# EAGLE design BLE v0.1a prater mod (EAGLE 6.4)
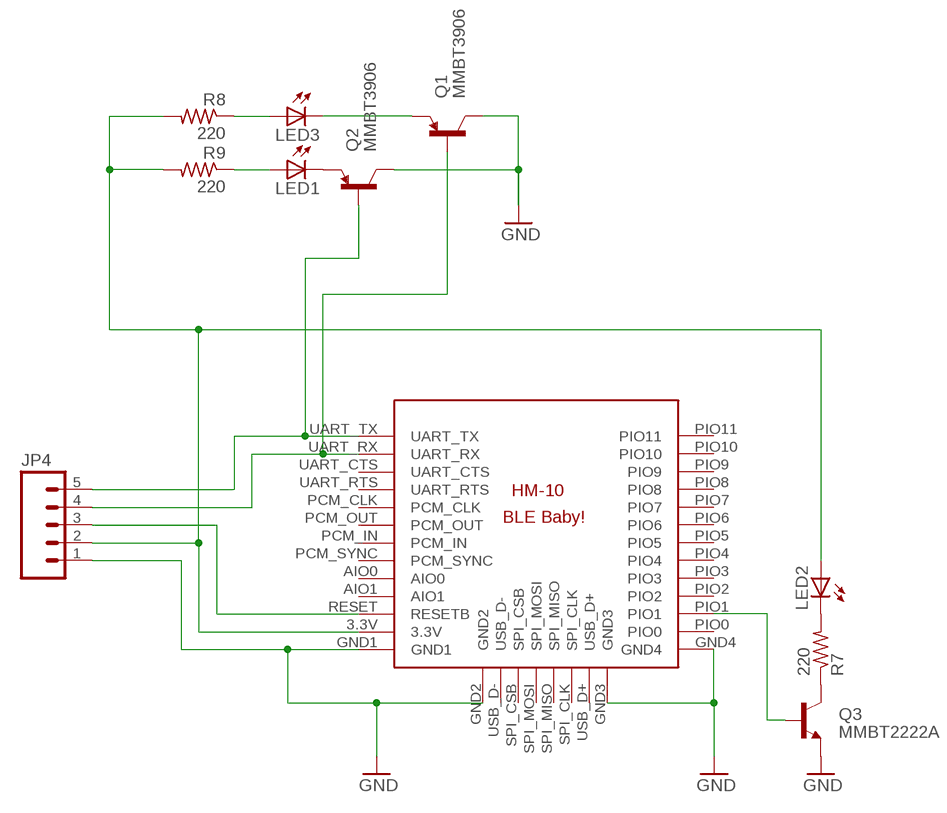
[diagram p0: schematic, sheet 1]

## Parts
JP4  M05PTH  [1X05]
LED1  LED0603  [LED-0603]
LED2  LED0603  [LED-0603]
LED3  LED0603  [LED-0603]
Q1  MMBT3906  TRANSISTOR_PNPMMBT3906  [SOT23]
Q2  MMBT3906  TRANSISTOR_PNPMMBT3906  [SOT23]
Q3  MMBT2222A  TRANSISTOR_NPNMMBT2222A  [SOT23]
R7  220  R-US_M0805  [M0805]
R8  220  R-US_M0805  [M0805]
R9  220  R-US_M0805  [M0805]
U$1  BLE-HM-10  [BLE-HM-10]

## Nets
GND: JP4.1 Q1.3(C) Q2.3(C) Q3.2(E) U$1.GND1 U$1.GND2 U$1.GND3 U$1.GND4
HVTX->LVRX: JP4.4 Q1.1(B) U$1.UART_RX
LVRX->HVTX: JP4.5 Q2.1(B) U$1.UART_TX
N$2: Q3.3(C) R7.1
N$4: JP4.2 LED2.A R8.2 R9.2 U$1.3.3V
N$5: JP4.3 U$1.RESET(RESETB)
N$25: Q3.1(B) U$1.PIO1
N$26: LED2.C R7.2
N$34: LED3.C Q1.2(E)
N$35: LED1.A R9.1
N$39: LED3.A R8.1
N$40: LED1.C Q2.2(E)
Unconnected: U$1.AIO0 U$1.AIO1 U$1.PCM_CLK U$1.PCM_IN U$1.PCM_OUT U$1.PCM_SYNC U$1.PIO0 U$1.PIO2 U$1.PIO3 U$1.PIO4 U$1.PIO5 U$1.PIO6 U$1.PIO7 U$1.PIO8 U$1.PIO9 U$1.PIO10 U$1.PIO11 U$1.SPI_CLK U$1.SPI_CSB U$1.SPI_MISO U$1.SPI_MOSI U$1.UART_CTS U$1.UART_RTS U$1.USB_D+ U$1.USB_D-

## Library data of the parts
JP4 = SparkFun-Connectors:M05: Header 5 Standard 5-pin 0.1" header. Use with straight break away headers (SKU : PRT-00116), right angle break away headers (PRT-00553), swiss pins (PRT-00743), machine pins (PRT-00117), and female headers (PRT-00115). Molex polarized connector foot print use with SKU : PRT-08230 with associated crimp pins and housings.
LED1-LED3 = SparkFun:LED: LEDs Standard schematic elements and footprints for 5mm, 3mm, 1206, and 0603 sized LEDs. 5mm - Spark Fun Electronics SKU : COM-00529 (and others)
Q1 Q2 = SparkFun-DiscreteSemi:TRANSISTOR_PNP: Generic PNP BJT Double check pinouts against datasheets- not all devices are the same! MMBT3906 - 40V 200mA SOT-23 (TRANS-08052) MMBT4403 - 40V 600mA SOT-23 (TRANS-09245); PROD_ID: TRANS-08052
Q3 = SparkFun-DiscreteSemi:TRANSISTOR_NPN: Generic NPN BJT MMBT2222A - TRANS-08049 (SOT-23, 1A 40V) MPSA42 - TRANS-09116 (SOT-23, 500mA 300V) MMBT5088LT1G - TRANS-11160 (SOT-23, 50 mA 30V); PROD_ID: TRANS-08049
R7-R9 = resistor:R-US_: RESISTOR, American symbol
U$1 = Random parts:BLE-HM-10

## Board
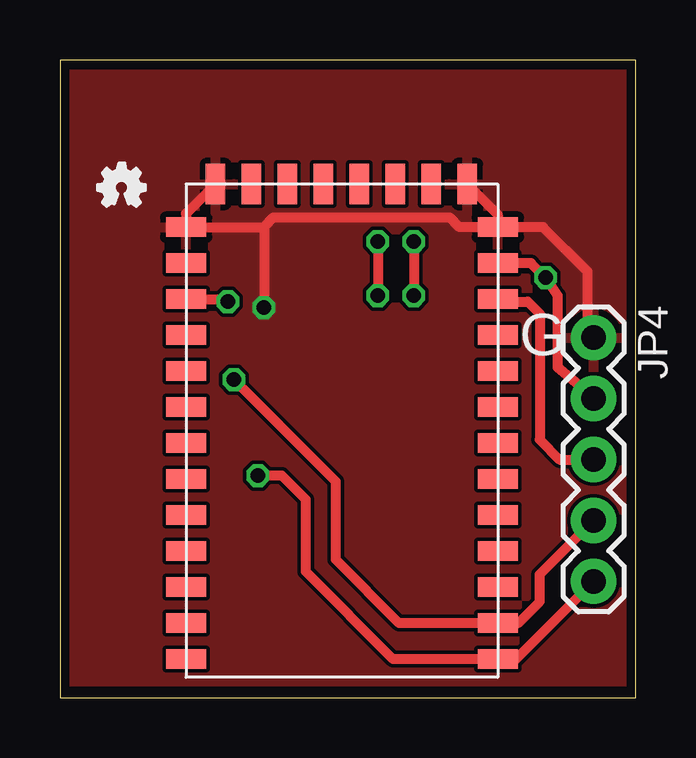
[diagram p1: board, top side]
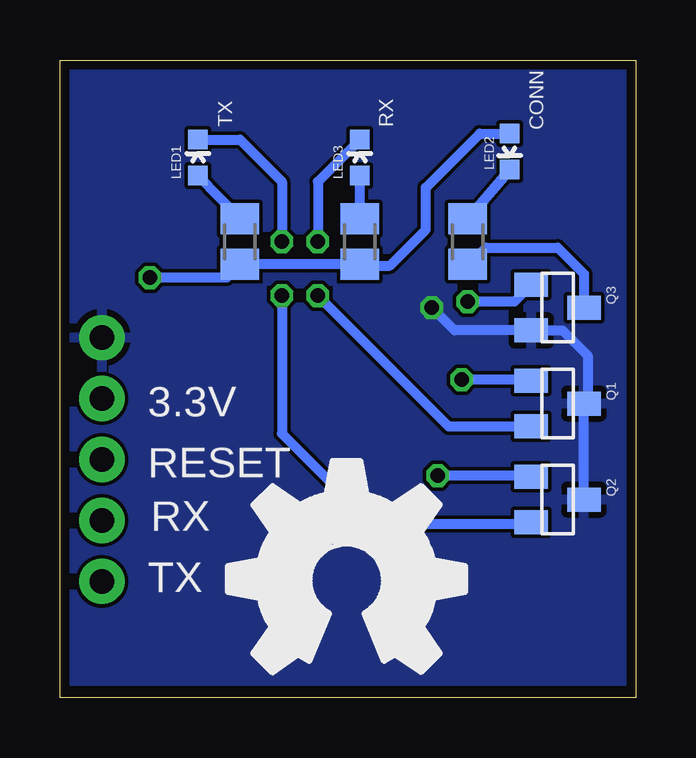
[diagram p2: board, bottom side, seen from below]

Size 24 x 26.57 mm. Coordinates in mm from the lower left corner, seen from the top.
Outline: 0,0 24,0 24,26.57 0,26.57 0,0
Copper layers (1*16): Top 0.0356mm / dielectric 1.5011mm / Bottom 0.0356mm
Design rules "LaenPCBOrder *": minimum track width 12mil, minimum drill 13mil, track to track 6mil, track to pad 6mil, pad to pad 6mil, via to via 6mil, smd to smd 6mil, copper to edge 15mil, drill to drill 6mil, minimum pad ring 7mil, minimum via ring 7mil, stop-mask expansion 4mil, vias tented up to drill 0mil, thermal gap 10mil

### Footprints (pad centres in the part's own frame; a part is rotated, then mirrored left to right if it is on the bottom)
1X05 = drill 1.016 pad 1.88: 1 0,0; 2 2.54,0; 3 5.08,0; 4 7.62,0; 5 10.16,0
LED-0603 = smd 0.8 x 0.8: A 0,-0.75; C 0,0.75
SOT23 = smd 1 x 1.4: 1 -0.95,-1.1; 2 0.95,-1.1; 3 0,1.1
M0805 = smd 1.3 x 1.6: 1 -0.95,0; 2 0.95,0
BLE-HM-10 = smd 1.676 x 0.813: 3.3V 0,3.29; AIO0 0,7.79; AIO1 0,6.29; GND1 0,1.79; GND4 13,1.79; PCM_CLK 0,13.79; PCM_IN 0,10.79; PCM_OUT 0,12.29; PCM_SYNC 0,9.29; PIO0 13,3.29; PIO1 13,4.79; PIO2 13,6.29; PIO3 13,7.79; PIO4 13,9.29; PIO5 13,10.79; PIO6 13,12.29; PIO7 13,13.79; PIO8 13,15.29; PIO9 13,16.79; PIO10 13,18.29; PIO11 13,19.79; RESET 0,4.79; UART_CTS 0,16.79; UART_RTS 0,15.29; UART_RX 0,18.29; UART_TX 0,19.79 | smd 0.813 x 1.676: GND2 1.27,0; GND3 11.77,0; SPI_CLK 8.77,0; SPI_CSB 4.27,0; SPI_MISO 7.27,0; SPI_MOSI 5.77,0; USB_D+ 10.27,0; USB_D- 2.77,0

### Placement (x,y rotation side)
JP4  22.25,15 270 top
LED1  18.25,22.5 0 bottom
LED2  5.25,22.75 180 bottom
LED3  11.5,22.5 0 bottom
Q1  3.25,12.25 270 bottom
Q2  3.25,8.25 270 bottom
Q3  3.25,16.25 270 bottom
R7  7,19 90 bottom
R8  11.5,19 270 bottom
R9  16.5,19 270 bottom
U$1  18.26,21.4 180 top
U$2  [OSHW_FILLX350_NOTEXT]  17.01,1.02 0 bottom
U$3  [OSHW_FILLX70_NOTEXT]  1.57,20.48 0 top

### Tracks (layer width: path | path; a pad name or v marks a point on that pad's centre or on a via)
GND  (via drill 0.6)
  Top 0.406: JP4.1 22,15.25 22,17.75 20.14,19.61 U$1.GND1 | U$1.GND2 18.26,20.13 U$1.GND1 | U$1.GND3 5.26,20.17 U$1.GND4 8.5,19.61 | 8.5,19.61 v8.5,16.25 | U$1.GND1 16.64,19.61 16.25,20 8.89,20 8.5,19.61
  Bottom 0.406: Q2.3 Q1.3 2,12.4 2,14.25 3.05,15.3 Q3.2 7.55,15.3 v8.5,16.25
  pour Bottom: -0.26,0.67 24.14,0.67 24.39,26.59 -0.01,26.59
  pour Top: 0,26.5 -0.25,0.68 24,0.68 24.25,26.5
HVTX->LVRX  (via drill 0.6)
  Top 0.406: JP4.4 20,5.13 20,4 19.11,3.11 U$1.UART_RX 14.14,3.11 11.5,5.75 11.5,9 v7.25,13.25
  Bottom 0.406: Q1.1 4.4,13.25 v7.25,13.25
LVRX->HVTX  (via drill 0.6)
  Top 0.406: 18.26,1.56 U$1.UART_TX | U$1.UART_TX 19.02,1.61 JP4.5 | U$1.UART_TX 13.89,1.61 10.25,5.25 10.25,8.25 9.25,9.25 v8.25,9.25
  Bottom 0.406: Q2.1 4.4,9.25 v8.25,9.25
N$2
  Bottom 0.406: R7.1 6.95,18.05 6.25,18.75 3.25,18.75 2.15,17.65 Q3.3
N$4  (via drill 0.6)
  Top 0.406: 18.26,18.01 U$1.3.3V 19.64,18.11 v20.25,17.5 20.75,16.75 20.75,13.75 22.25,12.5 JP4.2
  Bottom 0.406: LED2.A 6.5,23.5 8.75,21.25 8.75,19.5 10.25,18 11.45,18 R8.2 R9.2 17.05,17.5 v20.25,17.5
N$5
  Top 0.406: U$1.RESET 18.37,16.5 19.5,16.5 20,16 20,10.75 20.83,9.92 JP4.3
N$25  (via drill 0.6)
  Top 0.406: U$1.PIO1 6.89,16.61 v7,16.5
  Bottom 0.406: Q3.1 5.05,16.5 v7,16.5
N$26
  Bottom 0.406: LED2.C R7.2
N$34  (via drill 0.6)
  Top 0.406: v13.25,19 v13.25,16.75
  Bottom 0.406: LED3.C 13.25,21.5 v13.25,19 | v13.25,16.75 7.8,11.3 Q1.2
N$35
  Bottom 0.406: LED1.A R9.1
N$39
  Bottom 0.406: R8.1 LED3.A
N$40  (via drill 0.6)
  Top 0.406: v14.75,19 v14.75,16.75
  Bottom 0.406: LED1.C 16.5,23.25 14.75,21.5 v14.75,19 | v14.75,16.75 14.75,11 11,7.25 4.4,7.25 Q2.2

### Text on the board
tNames: G
bNames: CONN | RX | TX | 3.3V | RESET | RX | TX